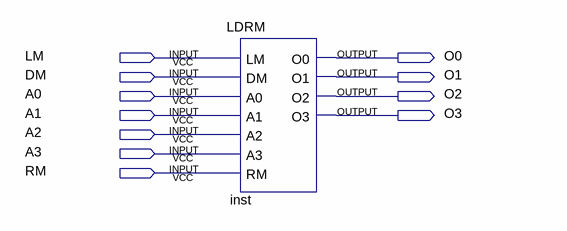
[diagram p0: schematic sheet]
// Quartus schematic exp4.bdf as structural Verilog: 1 symbols, 11 pins
module exp4 (
  input  LM,
  input  DM,
  input  A0,
  input  A1,
  input  A2,
  input  A3,
  input  RM,
  output O0,
  output O1,
  output O2,
  output O3
);

  LDRM inst (.LM(LM), .DM(DM), .A0(A0), .A1(A1), .A2(A2), .A3(A3), .RM(RM), .O0(O0), .O1(O1), .O2(O2), .O3(O3));
endmodule
